# Altium schematic sheet Borne.SchDoc
size A4
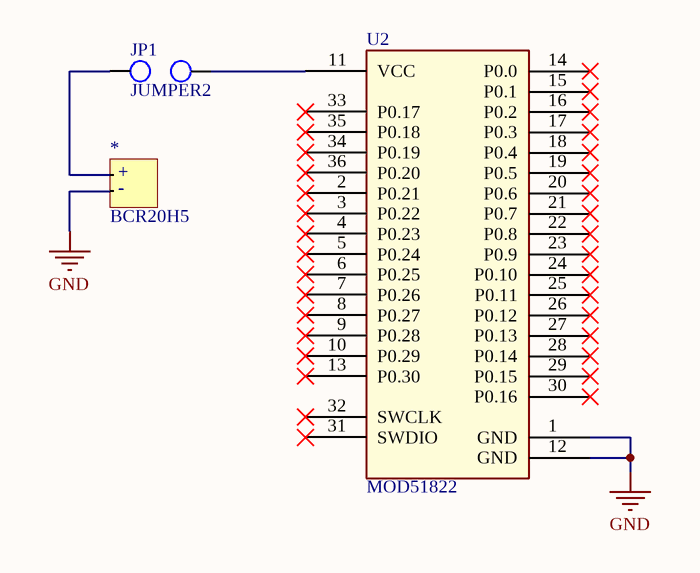
[diagram p0: Borne.SchDoc]

## Parts
*  BCR20H5  [BCR20H5]
JP1  JUMPER2  [BARRETTE_2_M_D]
U2  MOD51822  [MOD51822]

## Nets
GND: *.2 U2.1(GND) U2.12(GND)
Net*_1: *.1 JP1.1
NetJP1_2: JP1.2 U2.11(VCC)

Not connected (* = marked no-connect by the designer): U2 2(P0.21)* 3(P0.22)* 4(P0.23)* 5(P0.24)* 6(P0.25)* 7(P0.26)* 8(P0.27)* 9(P0.28)* 10(P0.29)* 13(P0.30)* 14(P0.0)* 15(P0.1)* 16(P0.2)* 17(P0.3)* 18(P0.4)* 19(P0.5)* 20(P0.6)* 21(P0.7)* 22(P0.8)* 23(P0.9)* 24(P0.10)* 25(P0.11)* 26(P0.12)* 27(P0.13)* 28(P0.14)* 29(P0.15)* 30(P0.16)* 31(SWDIO)* 32(SWCLK)* 33(P0.17)* 34(P0.19)* 35(P0.18)* 36(P0.20)*

## Notes on the sheet
- (in symbol BCR20H5) +; -

## Library data of the parts
JP1 = JUMPER2: BARRETTE 2 CONTACTS 1 RANGEE MALE DROITE; Type: JUMPER2